# EAGLE design cc2538node (EAGLE 7.1.0)
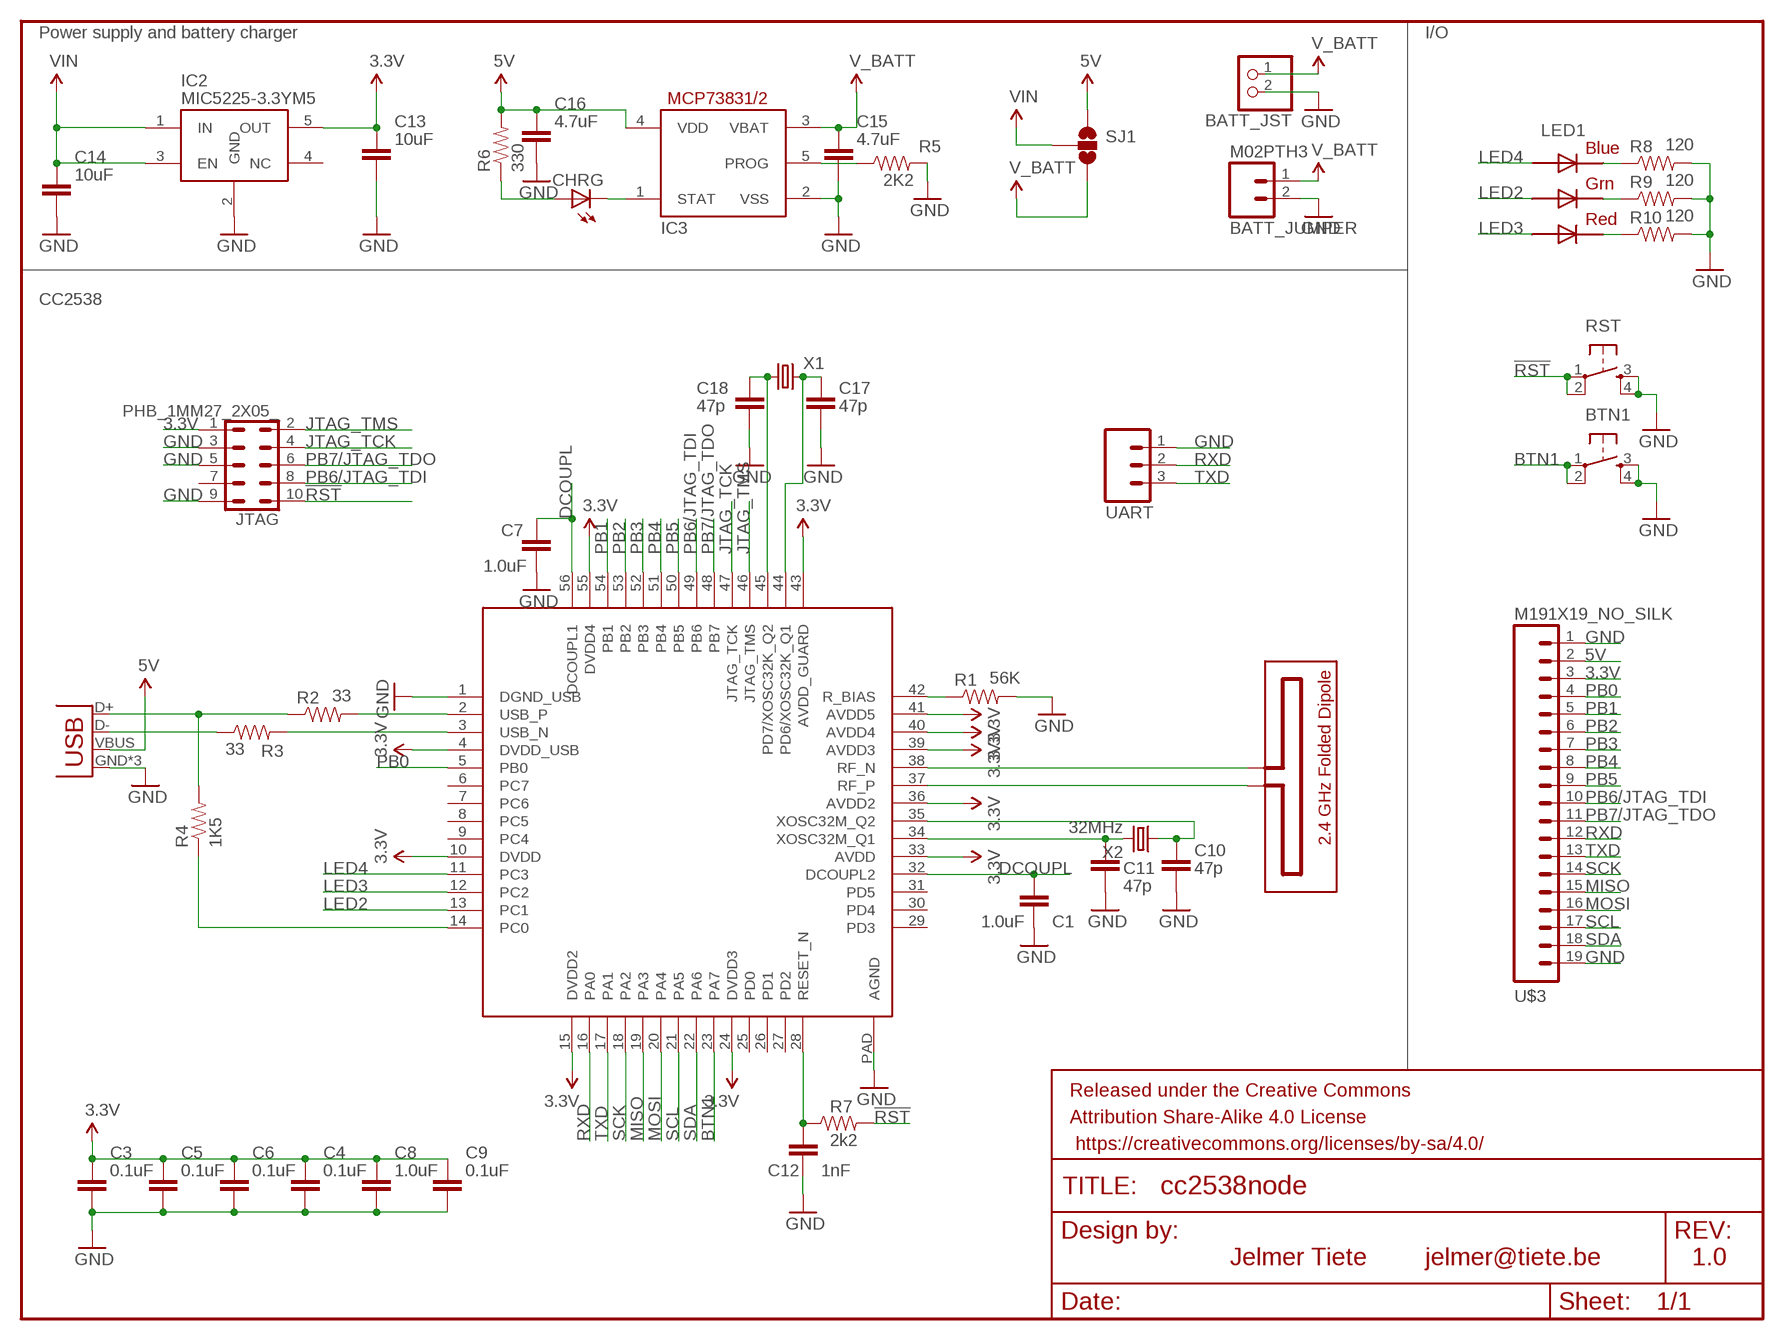
[diagram p0: schematic, sheet 1]

## Parts
BATT_JST  JST_2PIN-SMT-RA  [JST-PH-2-SMT-RA]
BATT_JUMPER  M02PTH3  [1X02_LONGPADS]
BTN1  TAC_SWITCHSMD  [TACTILE_SWITCH_SMD]
C1  1.0uF  CAPACITOR_NPOL-0603  [C603]
C3  0.1uF  CAPACITOR_NPOL-0603  [C603]
C4  0.1uF  CAPACITOR_NPOL-0603  [C603]
C5  0.1uF  CAPACITOR_NPOL-0603  [C603]
C6  0.1uF  CAPACITOR_NPOL-0603  [C603]
C7  1.0uF  CAPACITOR_NPOL-0603  [C603]
C8  1.0uF  CAPACITOR_NPOL-0603  [C603]
C9  0.1uF  CAPACITOR_NPOL-0603  [C603]
C10  47p  CAPACITOR_NPOL-0603  [C603]
C11  47p  CAPACITOR_NPOL-0603  [C603]
C12  1nF  CAPACITOR_NPOL-0603  [C603]
C13  10uF  CAPACITOR_NPOL-0603  [C603]
C14  10uF  CAPACITOR_NPOL-0603  [C603]
C15  4.7uF  CAPACITOR_NPOL-0603  [C603]
C16  4.7uF  CAPACITOR_NPOL-0603  [C603]
C17  47p  CAPACITOR_NPOL-0603  [C603]
C18  47p  CAPACITOR_NPOL-0603  [C603]
CHRG  LED-0603  [LED-603]
FRAME2  FRAME-LETTER  [CREATIVE_COMMONS]
IC1  CC2538  [QFN56]
IC2  MIC5225-3.3YM5  [SOT23-5]
IC3  MCP73831/OT  [SOT23-5L]
JP1  USB-MICROB  [USB-MICROB]
JTAG  PHB_1MM27_2X05_  [PHB_1MM27_2X05_SNT_NOSILK]
LED1  RGBLED5050  [RGBLED5050]
R1  56K  RESISTOR0805-RES  [0805]
R2  33  RESISTOR0805-RES  [0805]
R3  33  RESISTOR0805-RES  [0805]
R4  1K5  RESISTOR0805-RES  [0805]
R5  2K2  RESISTOR0805-RES  [0805]
R6  330  RESISTOR0805-RES  [0805]
R7  2k2  RESISTOR0805-RES  [0805]
R8  120  RESISTOR0805-RES  [0805]
R9  120  RESISTOR0805-RES  [0805]
R10  120  RESISTOR0805-RES  [0805]
RST  TAC_SWITCHSMD  [TACTILE_SWITCH_SMD]
SJ1  SOLDERJUMPER_2WAYPASTE1&2  [SJ_3_PASTE1&2]
U$1  FOLDED_DIPOLE_ANTENNE_2.4  [FOLDED_DIPOLE_2.4]
U$3  M191X19_NO_SILK  [1X19_NO_SILK]
UART  M031X03_NO_SILK  [1X03_NO_SILK]
X1  CRYSTAL32-SMD  [CRYSTAL-32KHZ-SMD]
X2  32MHz  CRYSTALCTS406  [CTS406]

## Nets
3.3V: C3.1 C4.1 C5.1 C6.1 C8.1 C9.1 C13.1 IC1.4(DVDD_USB) IC1.10(DVDD) IC1.15(DVDD2) IC1.24(DVDD3) IC1.33(AVDD) IC1.36(AVDD2) IC1.39(AVDD3) IC1.40(AVDD4) IC1.41(AVDD5) IC1.43(AVDD_GUARD) IC1.55(DVDD4) IC2.5(OUT) JTAG.1 U$3.3
5V: C16.1 IC3.4(VDD) JP1.VBUS R6.2 SJ1.1 U$3.2
!RST: JTAG.10 R7.2 RST.1 RST.2
BTN1: BTN1.1 BTN1.2 IC1.23(PA7)
DCOUPL: C1.1 C7.1 IC1.32(DCOUPL2) IC1.56(DCOUPL1)
GND: BATT_JST.2 BATT_JUMPER.2 BTN1.3 BTN1.4 C1.2 C3.2 C4.2 C5.2 C6.2 C7.2 C8.2 C9.2 C10.2 C11.2 C12.2 C13.2 C14.2 C15.2 C16.2 C17.2 C18.2 IC1.1(DGND_USB) IC1.PAD(AGND) IC2.2(GND) IC3.2(VSS) JP1.GND JP1.MT1(GND) JP1.MT2(GND) JTAG.3 JTAG.5 JTAG.9 R1.2 R5.2 R8.2 R9.2 R10.2 RST.3 RST.4 U$3.1 U$3.19 UART.1
JTAG_TCK: IC1.47(JTAG_TCK) JTAG.4
JTAG_TMS: IC1.46(JTAG_TMS) JTAG.2
LED2: IC1.13(PC1) LED1.1(GREEN_A)
LED3: IC1.12(PC2) LED1.2(RED_A)
LED4: IC1.11(PC3) LED1.3(BLUE_A)
MISO: IC1.19(PA3) U$3.15
MOSI: IC1.20(PA4) U$3.16
N$1: IC1.38(RF_N) U$1.P$1
N$2: IC1.37(RF_P) U$1.P$2
N$4: IC1.3(USB_N) R3.2
N$5: IC1.2(USB_P) R2.2
N$6: LED1.5(RED_C) R10.1
N$7: LED1.6(GREEN_C) R9.1
N$8: IC1.42(R_BIAS) R1.1
N$9: JP1.D+ R2.1 R4.2
N$10: JP1.D- R3.1
N$11: IC1.14(PC0) R4.1
N$12: IC3.5(PROG) R5.1
N$13: CHRG.C IC3.1(STAT)
N$14: CHRG.A R6.1
N$15: C11.1 IC1.34(XOSC32M_Q1) X2.3
N$16: C10.1 IC1.35(XOSC32M_Q2) X2.1
N$17: LED1.4(BLUE_C) R8.1
N$18: C17.1 IC1.44(PD6/XOSC32K_Q1) X1.X2
N$19: C18.1 IC1.45(PD7/XOSC32K_Q2) X1.X1
PB0: IC1.5(PB0) U$3.4
PB1: IC1.54(PB1) U$3.5
PB2: IC1.53(PB2) U$3.6
PB3: IC1.52(PB3) U$3.7
PB4: IC1.51(PB4) U$3.8
PB5: IC1.50(PB5) U$3.9
PB6/JTAG_TDI: IC1.49(PB6) JTAG.8 U$3.10
PB7/JTAG_TDO: IC1.48(PB7) JTAG.6 U$3.11
RESET_N: C12.1 IC1.28(RESET_N) R7.1
RXD: IC1.16(PA0) U$3.12 UART.2
SCK: IC1.18(PA2) U$3.14
SCL: IC1.21(PA5) U$3.17
SDA: IC1.22(PA6) U$3.18
TXD: IC1.17(PA1) U$3.13 UART.3
V_BATT: BATT_JST.1 BATT_JUMPER.1 C15.1 IC3.3(VBAT) SJ1.3
VIN: C14.1 IC2.1(IN) IC2.3(EN) SJ1.2
Unconnected: IC1.6(PC7) IC1.7(PC6) IC1.8(PC5) IC1.9(PC4) IC1.25(PD0) IC1.26(PD1) IC1.27(PD2) IC1.29(PD3) IC1.30(PD4) IC1.31(PD5) IC2.4(NC) JTAG.7

## Notes on the sheet
- Power supply and battery charger | I/O
- CC2538
- Jelmer Tiete | jelmer@tiete.be | 1.0

## Library data of the parts
BATT_JST = adafruit:JST_2PIN: JST 2-Pin Connectors of various flavors SMT-RA (S2B-PH-SM4) 4UConnector #17311 SMT (B2B-PH-SM4) THM-RA (S2B-PH) THM (B2B-PH)
BATT_JUMPER = SparkFun-Connectors:M02: Standard 2-pin 0.1" header. Use with - straight break away headers ( PRT-00116) - right angle break away headers (PRT-00553) - swiss pins (PRT-00743) - machine pins (PRT-00117) - female headers (PRT-00115) Molex polarized connector foot print use with: PRT-08233 with associated crimp pins and housings. 2.54_SCREWTERM for use with PRT-10571. 3.5mm Screw Terminal footprints for PRT-08084 5mm Screw Terminal footprints for use with PRT-08433
BTN1 RST = SparkFun-Electromechanical:TAC_SWITCH: Momentary Switch Button commonly used for reset or general input. Spark Fun Electronics SKU : COM-00097 SMT- SWCH-08247; PROD_ID: SWCH-08247
C1 C3-C18 = dp_devices:CAPACITOR_NPOL: Non-Polarized capacitor in various packages
CHRG = dp_devices:LED: Light Emitting Diode
FRAME2 = SparkFun-Aesthetics:FRAME-LETTER: Schematic Frame Standard 8.5x11 US Letter frame
IC1 = ic:CC2538
IC2 = usbug:MIC5225: Ultra-Low Quiescent Current 150mA µCap Low Dropout Regulator; VOLTAGE: 3.3V
IC3 = adafruit:MCP73831: MCP73831/2 Miniature Single-Cell, Fully Integrated Li-Ion, Li-Polymer Charge Management Controllers. Nice and small simple lipoly charge controller, with adjustable current and status output (LED) http://www.ladyada.net/library/pcb/eaglelibrary.html
JP1 = SparkFun-Connectors:USB: USB Connectors USB-B-PTH is fully proven SKU : PRT-00139/CONN-08278 USB-miniB is fully proven SKU : PRT-00587 USB-A-PCB is untested. USB-A-H is throughly reviewed, but untested. Spark Fun Electronics SKU : PRT-00437 USB-B-SMT is throughly reviewed, but untested. Needs silkscreen touching up. USB-A-S has not been used/tested USB-MB-H has not been used/tested USB-MICROB has been used. CONN-09505; PROD_ID: CONN-09505
JTAG = _hhn_con_pinhead_box_1mm27:PHB_1MM27_2X05_*: Pin Header Box-Type, 1.27mm/0.5"/50mil Pitch, 2x05 Circuits Note: see library description for an important note about THT-version
LED1 = adafruit:RGBLED: For 5050 RGB LEDs, the order of the LEDs may vary from one manufacturer to another!
R1-R10 = SparkFun-Resistors:RESISTOR: Resistor Basic schematic elements and footprints for 0603, 1206, and PTH resistors.
SJ1 = SparkFun-Passives:SOLDERJUMPER_2WAY: Solder Jumper 2 way solder jumper
U$1 = folded_dipole_2.4ghz:FOLDED_DIPOLE_ANTENNE_2.4
U$3 = SparkFun-Connectors:M19: 1x19 .1" header
UART = SparkFun-Connectors:M03: Header 3 Standard 3-pin 0.1" header. Use with straight break away headers (SKU : PRT-00116), right angle break away headers (PRT-00553), swiss pins (PRT-00743), machine pins (PRT-00117), and female headers (PRT-00115). Molex polarized connector foot print use with SKU : PRT-08232 with associated crimp pins and housings.
X1 = SparkFun-FreqCtrl:CRYSTAL: Various standard crystals. Proven footprints. Spark Fun Electronics SKU : COM-00534; PROD_ID: XTAL-07894
X2 = adafruit:CRYSTAL: CRYSTAL; OC_FARNELL: unknown; OC_NEWARK: unknown

## Board
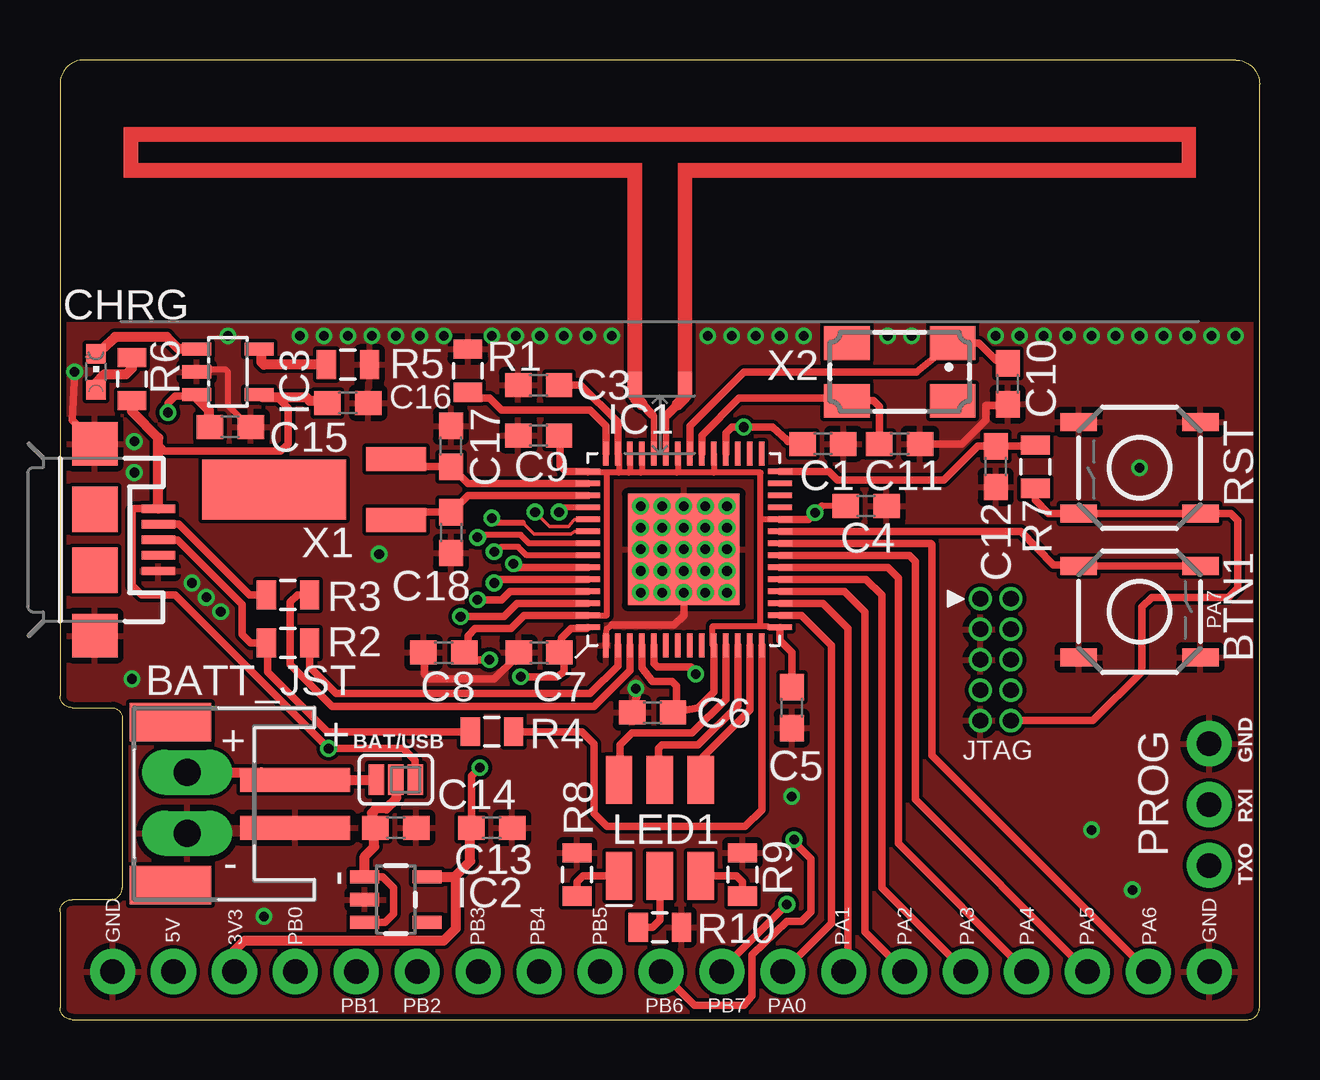
[diagram p1: board, top side]
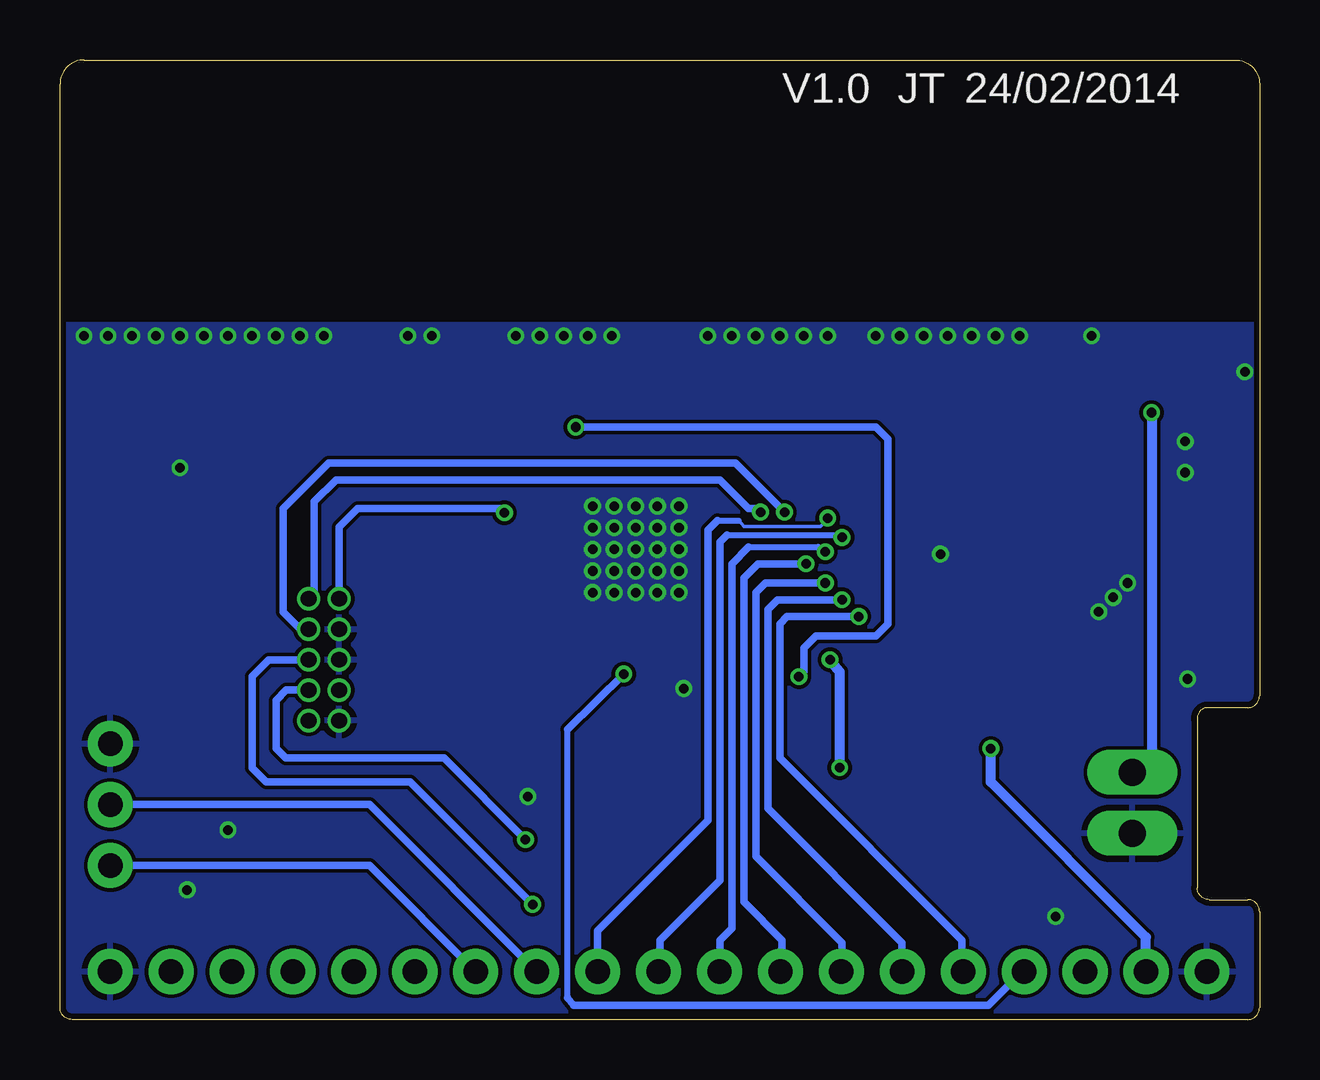
[diagram p2: board, bottom side, seen from below]

Size 50 x 40 mm. Coordinates in mm from the lower left corner, seen from the top.
Outline: 0.5,0 49.5,0 arc90 50,0.5 50,39 arc90 49,40 1,40 arc90 0,39 0,13.5 arc90 0.5,13 2.2,13 arc-90 2.6,12.5 2.6,5.5 arc-90 2.1,5 0.5,5 arc90 0,4.5 0,0.5 arc90 0.5,0
Copper layers (1*16): Top 0.035mm / dielectric 0.2mm / Bottom 0.035mm
Design rules "SeeedStudio_DRU_no_angle_20130527 *": minimum track width 6mil, minimum drill 12mil, track to track 6mil, track to pad 6mil, pad to pad 6mil, via to via 6mil, smd to smd 0mil, copper to edge 10mil, drill to drill 10mil, minimum pad ring 6mil, minimum via ring 6mil, stop-mask expansion 2mil, vias tented up to drill 25mil, thermal gap 10mil
tRestrict: area 0,29.1 to 2.1,40; area 47.9,29.1 to 50,40; area 24.6,25.7 to 25.4,26.2
bRestrict: area 0,29.1 to 2.1,40; area 47.9,29.1 to 50,40

### Footprints (pad centres in the part's own frame; a part is rotated, then mirrored left to right if it is on the bottom)
JST-PH-2-SMT-RA = smd 1 x 4.6: 1 1,-3.7; 2 -1,-3.7 | smd 1.6 x 3.4: NC1 -3.4,1.5; NC2 3.4,1.5
1X02_LONGPADS = drill 1.118 pad 1.88 long: 1 0,0; 2 2.54,0
TACTILE_SWITCH_SMD = smd 1.524 x 0.762: 1 -2.54,1.905; 2 2.54,1.905; 3 -2.54,-1.905; 4 2.54,-1.905
C603 = smd 1.1 x 1: 1 -0.85,0; 2 0.85,0
LED-603 = smd 0.8 x 0.8: A 0,-0.75; C 0,0.75
QFN56 = smd 1 x 0.24: 1 -4,3.25; 2 -4,2.75; 3 -4,2.25; 4 -4,1.75; 5 -4,1.25; 6 -4,0.75; 7 -4,0.25; 8 -4,-0.25; 9 -4,-0.75; 10 -4,-1.25; 11 -4,-1.75; 12 -4,-2.25; 13 -4,-2.75; 14 -4,-3.25; 29 4,-3.25; 30 4,-2.75; 31 4,-2.25; 32 4,-1.75; 33 4,-1.25; 34 4,-0.75; 35 4,-0.25; 36 4,0.25; 37 4,0.75; 38 4,1.25; 39 4,1.75; 40 4,2.25; 41 4,2.75; 42 4,3.25 | smd 0.24 x 1: 15 -3.25,-4; 16 -2.75,-4; 17 -2.25,-4; 18 -1.75,-4; 19 -1.25,-4; 20 -0.75,-4; 21 -0.25,-4; 22 0.25,-4; 23 0.75,-4; 24 1.25,-4; 25 1.75,-4; 26 2.25,-4; 27 2.75,-4; 28 3.25,-4; 43 3.25,4; 44 2.75,4; 45 2.25,4; 46 1.75,4; 47 1.25,4; 48 0.75,4; 49 0.25,4; 50 -0.25,4; 51 -0.75,4; 52 -1.25,4; 53 -1.75,4; 54 -2.25,4; 55 -2.75,4; 56 -3.25,4 | smd 4.65 x 4.65: PAD 0,0
SOT23-5 = smd 0.55 x 1.2: 1 -0.95,-1.3; 2 0,-1.3; 3 0.95,-1.3; 4 0.95,1.3; 5 -0.95,1.3
SOT23-5L = smd 0.55 x 1.2: 1 -0.95,-1.3; 2 0,-1.3; 3 0.95,-1.3; 4 0.95,1.3; 5 -0.95,1.3
USB-MICROB = smd 0.35 x 1.4: D+ 0,2.65; D- -0.65,2.65; GND 1.3,2.65; ID 0.65,2.65; VBUS -1.3,2.65 | smd 1.8 x 1.9: MT1 -4,0; MT2 4,0 | smd 1.9 x 1.9: P$1 -1.27,0; P$2 1.27,0
PHB_1MM27_2X05_SNT_NOSILK = drill 0.65: 1 -2.54,-0.635; 2 -2.54,0.635; 3 -1.27,-0.635; 4 -1.27,0.635; 5 0,-0.635; 6 0,0.635; 7 1.27,-0.635; 8 1.27,0.635; 9 2.54,-0.635; 10 2.54,0.635
RGBLED5050 = smd 2 x 1.1: 1 -2,1.7; 2 -2,0; 3 -2,-1.7; 4 2,-1.7; 5 2,0; 6 2,1.7
0805 = smd 0.8 x 1.2: 1 -0.9,0; 2 0.9,0
SJ_3_PASTE1&2 = smd 0.635 x 1.27: 1 -0.813,0; 2 0,0; 3 0.813,0
FOLDED_DIPOLE_2.4 = smd 0.6 x 1: P$1 -1.05,0.5; P$2 1.05,0.5
1X19_NO_SILK = drill 1.016 pad 1.88: 1 0,0; 2 2.54,0; 3 5.08,0; 4 7.62,0; 5 10.16,0; 6 12.7,0; 7 15.24,0; 8 17.78,0; 9 20.32,0; 10 22.86,0; 11 25.4,0; 12 27.94,0; 13 30.48,0; 14 33.02,0; 15 35.56,0; 16 38.1,0; 17 40.64,0; 18 43.18,0; 19 45.72,0
1X03_NO_SILK = drill 1.016 pad 1.88: 1 0,0; 2 2.54,0; 3 5.08,0
CRYSTAL-32KHZ-SMD = smd 2.5 x 6: SHEILD 0,5.08 | smd 1 x 2.5: X1 -1.27,0; X2 1.27,0
CTS406 = smd 1.9 x 1.4: 1 -2.2,-1.2; 2 2.2,-1.2; 3 2.2,1.2; 4 -2.2,1.2

### Placement (x,y rotation side)
BATT_JST  6.1,9 90 top
BATT_JUMPER  5.3,10.3 270 top
BTN1  45,17 0 top
C1  31.8,24 0 top
C3  19.95,26.45 180 top
C4  33.6,21.4 0 top
C5  30.5,13 270 top
C6  24.7,12.8 180 top
C7  19.97,15.3 180 top
C8  16,15.3 180 top
C9  19.95,24.35 180 top
C10  39.5,26.5 270 top
C11  35,24 0 top
C12  39,23.05 270 top
C13  18,8 0 top
C14  14,8 0 top
C15  7.1,24.7 0 top
C16  12,25.7 0 top
C17  16.3,23.9 90 top
C18  16.3,20.3 270 top
CHRG  1.5,27 0 top
FRAME2  -9,-18.4 0 top  (outside the outline)
IC1  26,19.6 90 top
IC2  14,5 270 top
IC3  7,27 270 top
JP1  1.45,20 270 top
JTAG  39,15 270 top
LED1  25,8 270 top
R1  17,27.05 90 top
R2  9.5,15.7 0 top
R3  9.5,17.7 0 top
R4  18,12 180 top
R5  12,27.3 0 top
R6  3,26.7 270 top
R7  40.65,23.05 270 top
R8  21.55,6.05 90 top
R9  28.45,6.05 90 top
R10  25,3.85 0 top
RST  45,23 180 top
SJ1  14,10 180 top
U$1  25,26 0 top
U$3  2.19,2 0 top
UART  47.9,11.5 270 top
X1  14,22.1 90 top
X2  35,27 180 top

### Tracks (layer width: path | path; a pad name or v marks a point on that pad's centre or on a via)
3.3V  (via drill 0.4)
  Top 0.254: IC1.55 22.8,16.85 22.8,22.8 | 22.8,22.8 22,22.8 IC1.43 | IC1.41 23.3,23.6 23.3,22.8 | 23.3,22.8 22.8,22.8 | IC1.24 29.2,20.85 | 29.2,20.85 29.2,22.8 27.25,22.8 | 27.25,22.8 25.7,22.8 | 25.7,22.8 24.2,22.8 | 24.2,22.8 23.7,22.8 | 23.7,22.8 23.3,22.8 | IC1.10 27.2,15.6 27.2,16.4 29.2,16.4 | 29.2,16.4 29.2,20.85 | 29.2,16.4 29.5,16.4 29.55,16.35 IC1.15 | IC1.33 27.25,22.8 | IC1.36 25.75,22.85 25.7,22.8 | IC1.39 24.25,22.85 24.2,22.8 | IC1.40 23.75,22.85 23.7,22.8 | C4.1 31.75,21.4
  Top 0.305: IC1.43 21.1,22.85 20.85,23.1 20.85,24.3 C9.1 | C3.1 21.7,26.45 23.25,24.9 IC1.41 | IC1.10 27.25,13.65 26.6,13 C6.1 25.7,13.15 25.7,13.9 25.5,14.1 24.7,14.1 24.25,14.65 IC1.4 | IC1.15 30,15.8 30.5,15.3 C5.1 | IC1.24 31.2,20.85 v31.48,21.12 31.75,21.4 | IC1.55 19.35,16.85 18.8,16.3 17.3,16.3 17,16 17,15.25 C8.1 16.95,15 v17.9,15 | C13.1 17.15,10.15 v17.5,10.5
  Top 0.406: U$3.3 7.27,2.87 7.7,3.3 16,3.3 16.5,3.8 16.5,5.9 16.45,5.95 | IC2.5 16.45,5.95 | 16.45,5.95 17.1,6.6 17.1,7.95 C13.1
  Bottom 0.305: JTAG.1 38.37,20.54 37.6,21.3 31.65,21.3 v31.48,21.12
  Bottom 0.406: v17.5,10.5 17.5,14.5 v17.9,15
5V  (via drill 0.4)
  Top 0.254: 8.4,25.95 9.05,25.95 | 4.3,23.7 4.2,23.8
  Top 0.305: JP1.VBUS 3.1,21.3 3,21.2 3,18.1 3.4,17.7 4.8,17.7 v11.2,11.3 14.3,11.3 14.8,10.8 14.8,10.01 SJ1.1 | 9.05,25.95 9.5,25.5 9.5,24 9.2,23.7 4.3,23.7
  Top 0.406: JP1.VBUS 4.1,23.7 | 4.1,23.7 4.1,24.25 3,25.35 R6.2 | IC3.4 8.4,25.95 10.25,25.95 10.4,25.8 10.85,25.8 C16.1 10.95,25.7 | 4.2,23.8 4.1,23.7
  Bottom 0.406: U$3.2 4.73,3.43 11.2,9.9 v11.2,11.3
!RST
  Top 0.305: R7.2 40.65,21.65 41.2,21.1 RST.2 RST.1 48.8,21.1 49.1,20.8 49.1,18 48.7,17.6 45.5,17.6 45.1,17.2 45.1,14.5 43.06,12.46 JTAG.10
BTN1
  Top 0.305: IC1.23 40.05,20.35 41.4,18.95 42.41,18.95 BTN1.1 BTN1.2
DCOUPL  (via drill 0.4)
  Top 0.305: C1.1 31,24.1 30.35,24.1 30.3,24.15 29.7,24.7 v28.5,24.7 28,24.7 27.75,24.45 IC1.32 | IC1.56 21.95,16.3 21.3,16.3 20.9,15.9 C7.1 21,14.95 21,14.5 20.7,14.29 v19.2,14.29
  Bottom 0.305: v28.5,24.7 16,24.7 15.5,24.2 15.5,16.5 16,16 18.5,16 19,15.5 19,14.5 v19.2,14.29
GND  (via drill 0.4)
  Top 0.254: 22.75,16 22.8,16.3 23,16.45 | C15.2 7.9,24.7 7,25.6 7,27 6.9,27.1 5.8,27.1 IC3.2
  Top 0.305: IC1.1 22.75,16 | 23,16.45 25.6,16.45 26,16.85 v26,17.8 v26,18.7 IC1.PAD | C7.2 19,15.1 18.1,14.2 15.4,14.2 15.2,14.4 15.2,15.05 C8.2 | C6.2 24.15,13.85 v24,13.8 | C11.2 37.6,24 38.6,25 38.6,25.6 39.45,25.6 C10.2 | 1,24.5 0.5,25 v0.61,27
  other vias: 5.5,18.2 6.1,17.6 6.7,17 3.1,24.1 3.1,22.8 14,28.5 15,28.5 16,28.5 18,28.5 19,28.5 20,28.5 21,28.5 22,28.5 23,28.5 27,28.5 28,28.5 29,28.5 30,28.5 31,28.5 34.5,28.5 35.5,28.5 39,28.5 40,28.5 41,28.5 42,28.5 43,28.5 44,28.5 45,28.5 46,28.5 47,28.5 48,28.5 49,28.5 7,28.5 3,14.2 13,28.5 12,28.5 11,28.5 10,28.5 26,19.6 24.2,21.4 25.1,21.4 26,21.4 26.9,21.4 27.8,21.4 27.8,20.5 26.9,20.5 26,20.5 25.1,20.5 24.2,20.5 24.2,19.6 25.1,19.6 26.9,19.6 27.8,19.6 25.1,18.7 24.2,18.7 24.2,17.8 25.1,17.8 26.9,17.8 27.8,17.8 27.8,18.7 26.9,18.7 43,7.9 44.7,5.4 45,23 30.5,9.3 8.5,4.3 13.3,19.4
  pour Top: 0,0 0,40 50,40 50,0
  pour Bottom: 0,40 50,40 50,0 0,0
JTAG_TCK  (via drill 0.4)
  Top 0.152: 21.85,20.85 21.45,20.85 21.4,20.8 21.2,20.55 20.4,20.55 v19.8,21.15
  Top 0.254: IC1.47 21.85,20.85
  Bottom 0.152: v19.8,21.15 20,21.3
  Bottom 0.305: JTAG.4 39.97,16.27 40.7,17 40.7,21.3 38.8,23.2 21.85,23.2 v19.8,21.15
JTAG_TMS  (via drill 0.4)
  Top 0.254: IC1.46 20.85,21.35 v20.8,21.15
  Bottom 0.254: v20.8,21.15 20.8,21.2 20.9,21.3
  Bottom 0.305: 20.9,21.3 21.3,21.3 22.5,22.5 38.5,22.5 39.4,21.6 39.4,17.77 JTAG.2
LED2
  Top 0.305: IC1.13 28.75,12.9 26.8,10.95 26.8,10.1 LED1.1
LED3
  Top 0.305: IC1.12 28.25,13.1 26.6,11.45 25.1,11.45 24.95,11.3 24.95,10.05 LED1.2
LED4
  Top 0.305: IC1.11 27.75,13.35 26.35,11.95 23.85,11.95 23.35,11.45 23.35,10.05 LED1.3
MISO
  Top 0.305: IC1.19 33.6,18.35 34.25,17.7 34.25,5.5 U$3.15
MOSI
  Top 0.305: IC1.20 34.5,18.85 34.95,18.4 34.95,7.34 U$3.16
N$1
  Top 0.27: IC1.38 24.75,25.15 24.7,25.2
  Top 0.35: 24.7,25.2 24.25,25.65
  Top 0.5: 23.95,26.05 23.95,25.95 24.25,25.65
  Top 0.6: U$1.P$1 23.95,26.05
N$2
  Top 0.27: IC1.37 25.25,25.15 25.3,25.2
  Top 0.35: 25.3,25.2 25.75,25.65
  Top 0.5: 26.05,26.05 26.05,25.95 25.75,25.65
  Top 0.6: U$1.P$2 26.05,26.05
N$4
  Top 0.305: R3.2 9.9,17.7 9.6,17.4 9.6,14.8 11.35,13.05 22.25,13.05 23.75,14.55 IC1.3
N$5
  Top 0.305: R2.2 10.4,14.7 11.5,13.6 22.1,13.6 23.25,14.75 IC1.2
N$6
  Top 0.305: LED1.5 25,4.15 24.7,3.85 R10.1
N$7
  Top 0.305: R9.1 28.45,5.75 28.2,6 LED1.6
N$8
  Top 0.305: IC1.42 22.75,24.75 22.1,25.4 18.4,25.4 17.9,25.9 17.25,25.9 R1.1
N$9
  Top 0.305: JP1.D+ 4.9,20 7.6,17.3 7.6,16.05 7.95,15.7 R2.1 8.65,15.65 8.65,14.5 11.15,12 R4.2
N$10
  Top 0.305: JP1.D- 4.95,20.65 7.9,17.7 R3.1
N$11
  Top 0.305: IC1.14 29.25,8.75 28.55,8.05 22.8,8.05 22.25,8.6 22.25,11.5 21.75,12 R4.1
N$12
  Top 0.406: R5.1 8.5,27.3 8.4,27.4 8.4,27.85 IC3.5
N$13
  Top 0.406: IC3.1 4.95,27.95 4.45,28.45 2.3,28.45 CHRG.C
N$14
  Top 0.406: CHRG.A 1.5,26.55 1.85,26.9 2.75,26.9 3,27.15 R6.1
N$15
  Top 0.305: IC1.34 26.75,24.35 28.3,25.9 32.7,25.9 X2.3 33.9,25.8 34.15,25.55 C11.1
N$16
  Top 0.305: IC1.35 26.25,24.75 28.5,27 35.7,27 X2.1 38.3,28.2 39,27.5 39.35,27.5 C10.1
N$17
  Top 0.305: R8.1 21.55,5.75 21.8,6 LED1.4
N$18
  Top 0.305: IC1.44 17,22.35 C17.1 14.22,23.05 X1.X2
N$19
  Top 0.305: IC1.45 17,21.85 C18.1 14.32,21.15 X1.X1
PB0  (via drill 0.4)
  Top 0.305: v26.5,14.4 26.3,14.7 24.9,14.7 24.75,14.85 IC1.5
  Bottom 0.254: 28.85,0.9 28.85,12.1
  Bottom 0.305: U$3.4 9.9,2 11.3,0.6 28.6,0.6 28.85,0.9 | 28.85,12.1 v26.5,14.4
PB1  (via drill 0.4)
  Top 0.305: IC1.54 19.05,17.35 18.5,16.8 v16.7,16.8
  Bottom 0.305: v16.7,16.8 19.7,16.8 20,16.5 20,10.9 12.4,3.3 12.4,2.05 U$3.5
PB2  (via drill 0.4)
  Top 0.305: IC1.53 18.75,17.85 18.4,17.5 v17.4,17.5
  Bottom 0.305: v17.4,17.5 20.1,17.5 20.5,17.1 20.5,8.8 14.9,3.2 U$3.6
PB3  (via drill 0.4)
  Top 0.305: IC1.52 18.15,18.34 v18.1,18.2
  Bottom 0.305: v18.1,18.2 20.6,18.2 21,17.8 21,6.8 17.4,3.2 17.4,2.03 U$3.7
PB4  (via drill 0.4)
  Top 0.305: IC1.51 18.95,18.85 v18.9,19
  Bottom 0.305: v18.9,19 20.9,19 21.5,18.4 21.5,4.9 19.9,3.3 19.9,2.07 U$3.8
PB5  (via drill 0.4)
  Top 0.254: IC1.50 19.45,19.35 19.1,19.7 18.4,19.7 v18.1,19.5
  Bottom 0.254: 21.3,19.7 18.4,19.7 18.2,19.5 v18.1,19.5
  Bottom 0.305: 21.3,19.7 22,19 22,3.8 22.5,3.3 U$3.9
PB6/JTAG_TDI  (via drill 0.4)
  Top 0.254: IC1.49 19.55,19.85 19.2,20.2 17.6,20.2 17.5,20.1 v17.4,20.1
  Top 0.305: U$3.10 26.45,0.6 28.5,0.6 28.85,1 28.85,2.7 30.3,4.1 30.9,4.1 31.3,4.5 31.3,6.7 30.6,7.4 v30.6,7.5
  Bottom 0.254: 22.2,20.2 17.5,20.2 v17.4,20.1
  Bottom 0.305: 22.2,20.2 22.5,19.9 22.5,5.8 25,3.3 25,2.05 U$3.10 | JTAG.8 40.57,13.73 41,13.3 41,11.3 40.6,10.9 34,10.9 v30.6,7.5
PB7/JTAG_TDO  (via drill 0.4)
  Top 0.152: IC1.48 21.45,20.35 21.3,20.23 19.75,20.23 19.3,20.7
  Top 0.254: 19.3,20.7 18,20.7 v18,20.9
  Top 0.305: 27.6,1.9 U$3.11 | U$3.11 27.6,2.1 v30.3,4.8 | U$3.11
  Bottom 0.152: 21.7,20.8 21.5,20.56 18.3,20.56 v18,20.9
  Bottom 0.254: 22.6,20.8 21.7,20.8
  Bottom 0.305: 22.6,20.8 23,20.4 23,8.3 27.6,3.7 U$3.11 | JTAG.6 41.3,15 42,14.3 42,10.5 41.4,9.9 35.4,9.9 v30.3,4.8
RESET_N
  Top 0.305: R7.1 40.6,23.9 C12.1 38.25,23.9 36.85,22.5 32.4,22.5 32.05,22.85 IC1.28
RXD
  Top 0.305: IC1.16 30.9,16.85 32.15,15.6 32.15,4.02 U$3.12
  Bottom 0.305: UART.2 37.09,8.96 U$3.12
SCK
  Top 0.305: IC1.18 32.7,17.85 33.55,17 33.55,3.66 U$3.14
SCL
  Top 0.305: IC1.21 35.4,19.35 35.65,19.1 35.65,9.18 U$3.17
SDA
  Top 0.305: IC1.22 36.3,19.85 36.35,19.8 36.35,11.02 U$3.18
TXD
  Top 0.305: IC1.17 31.8,17.35 32.85,16.3 32.85,2.18 U$3.13
  Bottom 0.305: UART.3 37.09,6.42 U$3.13
V_BATT  (via drill 0.4)
  Top 0.305: C15.1 6.25,25.35 5.6,26 4.8,26 4.5,25.7 v4.5,25.3
  Top 0.406: IC3.3 5.7,25.9 6.2,25.4 6.2,24.75 C15.1 | BATT_JUMPER.1 8.39,10.3 BATT_JST.1 SJ1.3
  Bottom 0.406: v4.5,25.3 4.5,10.61 BATT_JUMPER.1
VIN
  Top 0.305: IC2.1 13.45,5.95 13.9,5.5 13.9,4.4 13.55,4.05 IC2.3
  Top 0.406: SJ1.2 14,9.2 13.6,8.8 13.2,8.8 13,8.6 13,8.15 C14.1 13.1,7.95 13.1,7.2 12.7,6.8 IC2.1

### Text on the board
tPlace: PA7 | + | BAT/USB | GND | RXI | PROG | - | TXO | GND | 5V | 3V3 | PB0 | PB3 | PB4 | PB5 | PA1 | PA2 | PA3 | PA4 | PA5 | PA6 | GND | PB1 | PB2 | PB6 | PB7 | PA0
bPlace: 24/02/2014 | JT | V1.0
tDocu: Jelmer Tiete